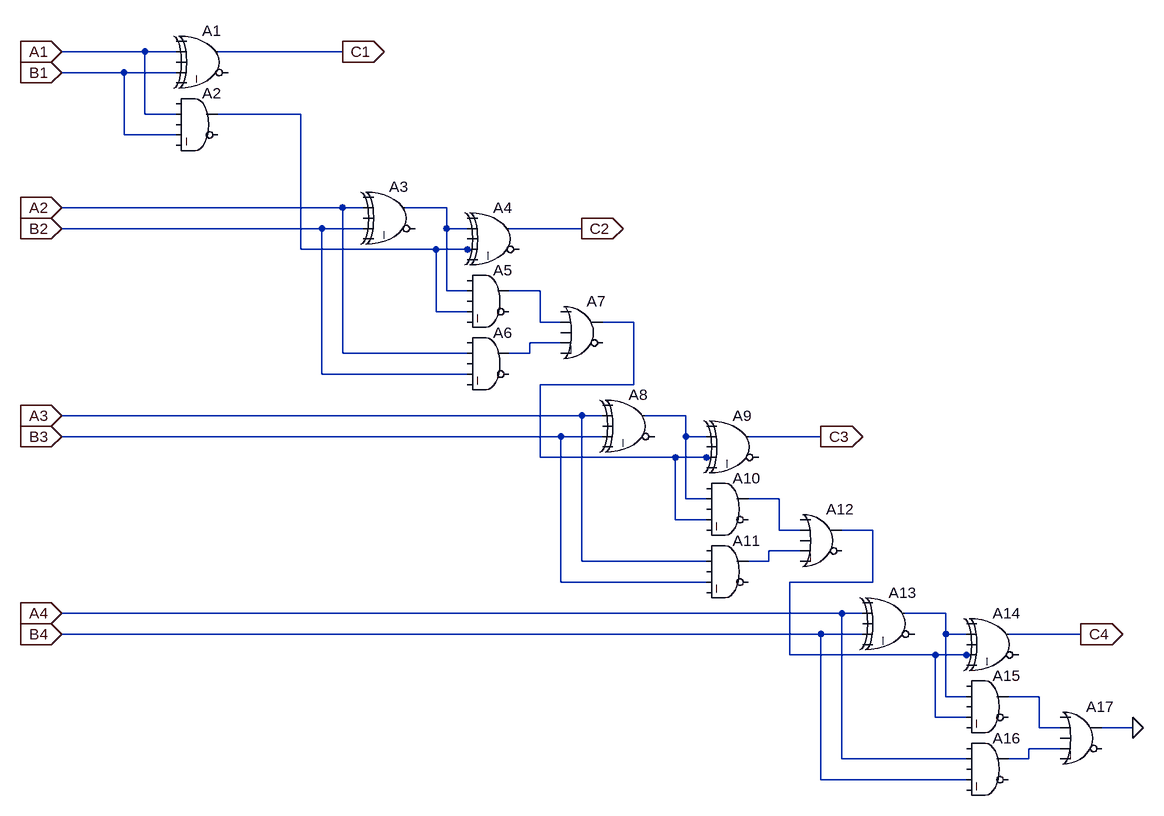
[diagram p0: schematic test.asc]
test.asc, the LTspice schematic file:
Version 4
SHEET 1 2100 968
WIRE 560 -176 432 -176
WIRE 608 -176 560 -176
WIRE 864 -176 672 -176
WIRE 528 -144 432 -144
WIRE 608 -144 528 -144
WIRE 560 -80 560 -176
WIRE 608 -80 560 -80
WIRE 800 -80 672 -80
WIRE 528 -48 528 -144
WIRE 608 -48 528 -48
WIRE 864 64 432 64
WIRE 896 64 864 64
WIRE 1024 64 960 64
WIRE 832 96 432 96
WIRE 896 96 832 96
WIRE 1024 96 1024 64
WIRE 1056 96 1024 96
WIRE 1232 96 1120 96
WIRE 800 128 800 -80
WIRE 1008 128 800 128
WIRE 1056 128 1008 128
WIRE 1072 128 1056 128
WIRE 1024 192 1024 96
WIRE 1056 192 1024 192
WIRE 1168 192 1120 192
WIRE 1008 224 1008 128
WIRE 1056 224 1008 224
WIRE 1168 240 1168 192
WIRE 1200 240 1168 240
WIRE 1312 240 1264 240
WIRE 1200 272 1152 272
WIRE 864 288 864 64
WIRE 1056 288 864 288
WIRE 1152 288 1152 272
WIRE 1152 288 1120 288
WIRE 832 320 832 96
WIRE 1056 320 832 320
WIRE 1312 336 1312 240
WIRE 1312 336 1168 336
WIRE 1232 384 432 384
WIRE 1264 384 1232 384
WIRE 1392 384 1328 384
WIRE 1200 416 432 416
WIRE 1264 416 1200 416
WIRE 1392 416 1392 384
WIRE 1424 416 1392 416
WIRE 1600 416 1488 416
WIRE 1168 448 1168 336
WIRE 1376 448 1168 448
WIRE 1424 448 1376 448
WIRE 1440 448 1424 448
WIRE 1392 512 1392 416
WIRE 1424 512 1392 512
WIRE 1536 512 1488 512
WIRE 1376 544 1376 448
WIRE 1424 544 1376 544
WIRE 1536 560 1536 512
WIRE 1568 560 1536 560
WIRE 1680 560 1632 560
WIRE 1568 592 1520 592
WIRE 1232 608 1232 384
WIRE 1424 608 1232 608
WIRE 1520 608 1520 592
WIRE 1520 608 1488 608
WIRE 1200 640 1200 416
WIRE 1424 640 1200 640
WIRE 1680 640 1680 560
WIRE 1680 640 1552 640
WIRE 1632 688 432 688
WIRE 1664 688 1632 688
WIRE 1792 688 1728 688
WIRE 1600 720 432 720
WIRE 1664 720 1600 720
WIRE 1792 720 1792 688
WIRE 1824 720 1792 720
WIRE 2000 720 1888 720
WIRE 1552 752 1552 640
WIRE 1776 752 1552 752
WIRE 1824 752 1776 752
WIRE 1840 752 1824 752
WIRE 1792 816 1792 720
WIRE 1824 816 1792 816
WIRE 1936 816 1888 816
WIRE 1776 848 1776 752
WIRE 1824 848 1776 848
WIRE 1936 864 1936 816
WIRE 1968 864 1936 864
WIRE 2080 864 2032 864
WIRE 1968 896 1920 896
WIRE 1632 912 1632 688
WIRE 1824 912 1632 912
WIRE 1920 912 1920 896
WIRE 1920 912 1888 912
WIRE 1600 944 1600 720
WIRE 1824 944 1600 944
FLAG 864 -176 С1
IOPIN 864 -176 Out
FLAG 1232 96 С2
IOPIN 1232 96 Out
FLAG 1600 416 С3
IOPIN 1600 416 Out
FLAG 2000 720 С4
IOPIN 2000 720 Out
FLAG 2080 864 0
FLAG 432 64 A2
IOPIN 432 64 In
FLAG 432 384 A3
IOPIN 432 384 In
FLAG 432 688 A4
IOPIN 432 688 In
FLAG 432 -176 A1
IOPIN 432 -176 In
FLAG 432 -144 B1
IOPIN 432 -144 In
FLAG 432 96 B2
IOPIN 432 96 In
FLAG 432 416 B3
IOPIN 432 416 In
FLAG 432 720 B4
IOPIN 432 720 In
SYMBOL Digital\\xor 656 -224 R0
SYMATTR InstName A1
SYMBOL Digital\\and 640 -128 R0
SYMATTR InstName A2
SYMBOL Digital\\xor 944 16 R0
SYMATTR InstName A3
SYMBOL Digital\\xor 1104 48 R0
SYMATTR InstName A4
SYMBOL Digital\\and 1088 144 R0
SYMATTR InstName A5
SYMBOL Digital\\and 1088 240 R0
SYMATTR InstName A6
SYMBOL Digital\\or 1232 192 R0
SYMATTR InstName A7
SYMBOL Digital\\xor 1312 336 R0
SYMATTR InstName A8
SYMBOL Digital\\xor 1472 368 R0
SYMATTR InstName A9
SYMBOL Digital\\and 1456 464 R0
SYMATTR InstName A10
SYMBOL Digital\\and 1456 560 R0
SYMATTR InstName A11
SYMBOL Digital\\or 1600 512 R0
SYMATTR InstName A12
SYMBOL Digital\\xor 1712 640 R0
SYMATTR InstName A13
SYMBOL Digital\\xor 1872 672 R0
SYMATTR InstName A14
SYMBOL Digital\\and 1856 768 R0
SYMATTR InstName A15
SYMBOL Digital\\and 1856 864 R0
SYMATTR InstName A16
SYMBOL Digital\\or 2000 816 R0
SYMATTR InstName A17

The netlist it stands for:
* test.asc
A1 0 A1 0 B1 0 0 С1 0 XOR
A2 0 A1 0 B1 0 0 N001 0 AND
A3 0 A2 0 B2 0 0 N002 0 XOR
A4 0 N002 0 N001 0 0 С2 0 XOR
A5 0 N002 0 N001 0 0 N003 0 AND
A6 0 A2 0 B2 0 0 N005 0 AND
A7 0 N003 0 N005 0 0 N004 0 OR
A8 0 A3 0 B3 0 0 N006 0 XOR
A9 0 N006 0 N004 0 0 С3 0 XOR
A10 0 N006 0 N004 0 0 N007 0 AND
A11 0 A3 0 B3 0 0 N009 0 AND
A12 0 N007 0 N009 0 0 N008 0 OR
A13 0 A4 0 B4 0 0 N010 0 XOR
A14 0 N010 0 N008 0 0 С4 0 XOR
A15 0 N010 0 N008 0 0 N011 0 AND
A16 0 A4 0 B4 0 0 N012 0 AND
A17 0 N011 0 N012 0 0 0 0 OR
.backanno
.end